# Altium schematic sheet SensorBoard.SchDoc
size A
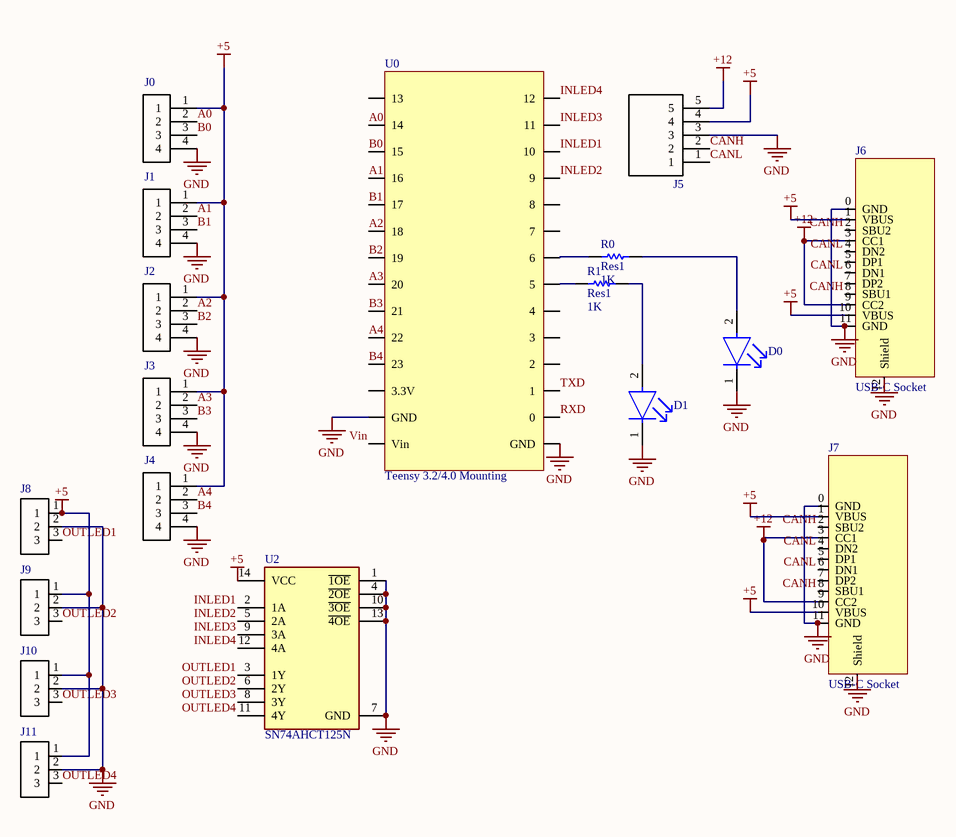
[diagram p0: SensorBoard.SchDoc]

## Parts
D0  Diode_Lumex_SSL-LX5093GD_eec  [Lumex_SSL-LX5093GD_0]  (value not drawn)
D1  Diode_Lumex_SSL-LX5093GD_eec  [Lumex_SSL-LX5093GD_0]  (value not drawn)
J0  282834-4  [*HDRV4W85P254_4X1_1062X650X1000]  (value not drawn)
J1  282834-4  [*HDRV4W85P254_4X1_1062X650X1000]  (value not drawn)
J2  282834-4  [*HDRV4W85P254_4X1_1062X650X1000]  (value not drawn)
J3  282834-4  [*HDRV4W85P254_4X1_1062X650X1000]  (value not drawn)
J4  282834-4  [*HDRV4W85P254_4X1_1062X650X1000]  (value not drawn)
J5  282834-5  [*TE_282834-5]  (value not drawn)
J6  USB-C Socket  [TYPE-C-31-M-12]
J7  USB-C Socket  [TYPE-C-31-M-12]
J8  282834-3  [*TE_282834-3]  (value not drawn)
J9  282834-3  [*TE_282834-3]  (value not drawn)
J10  282834-3  [*TE_282834-3]  (value not drawn)
J11  282834-3  [*TE_282834-3]  (value not drawn)
R0  Res1  value 1K  [AXIAL-0.3]
R1  Res1  value 1K  [AXIAL-0.3]
U0  Teensy 3.2/4.0 Mounting  [Teensy 3.2-4.0]
U2  Part Number: SN74AHCT125N  [Texas_Instruments_SN74AHCT125N_0]  (hidden comment: IC_Texas_Instruments_SN74AHCT125N_eec)

## Nets
+5: J0.1 J1.1 J2.1 J3.1 J4.1 J5.4 J6.1(VBUS) J6.10(VBUS) J7.1(VBUS) J7.10(VBUS) J8.1 J9.1 J10.1 J11.1 U2.14(VCC)
+12: J5.5 J6.3(CC1) J6.9(CC2) J7.3(CC1) J7.9(CC2)
GND: D0.1(C) D1.1(C) J0.4 J1.4 J2.4 J3.4 J4.4 J5.3 J6.0(GND) J6.11(GND) J6.12(Shield) J7.0(GND) J7.11(GND) J7.12(Shield) J8.2 J9.2 J10.2 J11.2 U0.GND U0.GND2(GND) U2.1(~{1OE}) U2.4(~{2OE}) U2.7(GND) U2.10(~{3OE}) U2.13(~{4OE})
A0: J0.2 U0.14
A1: J1.2 U0.16
A2: J2.2 U0.18
A3: J3.2 U0.20
A4: J4.2 U0.22
B0: J0.3 U0.15
B1: J1.3 U0.17
B2: J2.3 U0.19
B3: J3.3 U0.21
B4: J4.3 U0.23
CANH: J5.2 J6.2(SBU2) J6.8(SBU1) J7.2(SBU2) J7.8(SBU1)
CANL: J5.1 J6.4(DN2) J6.6(DN1) J7.4(DN2) J7.6(DN1)
INLED1: U0.10 U2.2(1A)
INLED2: U0.9 U2.5(2A)
INLED3: U0.11 U2.9(3A)
INLED4: U0.12 U2.12(4A)
OUTLED1: J8.3 U2.3(1Y)
OUTLED2: J9.3 U2.6(2Y)
OUTLED3: J10.3 U2.8(3Y)
OUTLED4: J11.3 U2.11(4Y)
RXD: U0.0
TXD: U0.1
Vin: U0.Vin
NetD0_2: D0.2(A) R0.2
NetD1_2: D1.2(A) R1.2
NetR0_1: R0.1 U0.6
NetR1_1: R1.1 U0.5

Not connected (* = marked no-connect by the designer): J6 5(DP1) 7(DP2); J7 5(DP1) 7(DP2); U0 2 3 3.3V 4 7 8 13

## Library data of the parts
D0 D1 = Diode_Lumex_SSL-LX5093GD_eec: DIODE LED GRN DIFF 5MM ROUND T/H; Manufacturer: Lumex; Current: 20mA; Voltage - Forward (Vf) (Typ): 2.2V; Viewing Angle: 60°; Part Number: SSL-LX5093GD; helpURL: https://upverter.com/upn/revision/3e2d87dde4bc0270/; ComponentLink2Description: Datasheet; Temperature: -40°C to +85°C; Package: RADIAL; Supplier 2: Mouser; Price: 0.134141512812; Supplier 1: Digi-Key; ComponentLink1URL: https://upverter.com/upn/revision/3e2d87dde4bc0270/; Supplier Part Number 2: 696-SSL-LX5093GD; Supplier Part Number 1: 67-1098-ND; ComponentLink1Description: Upverter; ComponentLink2URL: https://upverter.com/datasheet/272633366bbf9b7ac85ecec6850b6be956700e69.pdf; RoHS: TRUE; Mouser Part Number: 696-SSL-LX5093GD; Temperature Range High: +85°C; Digikey Description: DIODE LED GRN DIFF 5MM ROUND T/H; Digikey Part Number: 67-1098-ND; Lead Free: yes; Temperature Range Low: -40°C
J0-J4 = 282834-4: 4 Position Wire to Board Terminal Block Horizontal with Board 0.100 _2.54mm_ Through Hole; Number_of_Positions: 4; MF: TE Connectivity; Centerline_Pitch: 2.54 mm[.1 in]; Price: None; Package: None; TE_purchase_URL: https://www.te.com/usa-en/product-282834-4.html?te_bu=Cor&te_type=disp&te_campaign=seda_glo_cor-seda-global-disp-prtnr-fy19-seda-model-bom-cta_sma-317_1&elqCampaignId=32493; Availability: Unavailable; SnapEDA_Link: https://www.snapeda.com/parts/282834-4/TE%20Connectivity%20AMP%20Connectors/view-part/448422/?ref=snap; EU_RoHS_Compliance: Compliant with Exemptions; MP: 282834-4; Value: *
J5 = 282834-5: Buchanan; Conn; Term Blk; PCB; 5; 2.54mm; Front; 30-16 AWG; Green; 10 A; 150 V; MF: TE Connectivity; Price: None; SnapEDA_Link: https://www.snapeda.com/parts/282834-5/TE%20Connectivity%20AMP%20Connectors/view-part/641357/?ref=snap; EU_RoHS_Compliance: Compliant with Exemptions; MP: 282834-5; TE_purchase_URL: https://www.te.com/usa-en/product-282834-5.html?te_bu=Cor&te_type=disp&te_campaign=seda_glo_cor-seda-global-disp-prtnr-fy19-seda-model-bom-cta_sma-317_1&elqCampaignId=32493; Package: None; Availability: Unavailable; Value: *
J6 J7 = TYPE-C-31-M-12
J8-J11 = 282834-3: 3 Position Wire to Board Terminal Block Horizontal with Board 0.100 _2.54mm_; MF: TE Connectivity; Availability: Unavailable; Price: None; SnapEDA_Link: https://www.snapeda.com/parts/282834-3/TE%20Connectivity%20AMP%20Connectors/view-part/398089/?ref=snap; EU_RoHS_Compliance: Compliant with Exemptions; TE_purchase_URL: https://www.te.com/usa-en/product-282834-3.html?te_bu=Cor&te_type=disp&te_campaign=seda_glo_cor-seda-global-disp-prtnr-fy19-seda-model-bom-cta_sma-317_1&elqCampaignId=32493; MP: 282834-3; Package: None; Value: *
R0 R1 = Res1: Resistor; Published: 8-Jun-2000; LatestRevisionDate: 17-Jul-2002; LatestRevisionNote: Re-released for DXP Platform.; PackageReference: AXIAL-0.3; Publisher: Altium Limited; PackageDescription: Axial Device, Thru-Hole; 2 Leads; 0.3 in Pin Spacing
U0 = Teensy 3.2/4.0
U2 = IC_Texas_Instruments_SN74AHCT125N_eec: IC BUS BUFFER TRI-ST QD 14DIP; Manufacturer: Texas Instruments; helpURL: https://upverter.com/upn/revision/1c4f862725617c4f/; ComponentLink2Description: Datasheet; Temperature: -40°C to +125°C; Package: PDIP-14; Supplier 2: Mouser; Price: 0.244397165503; Supplier 1: Digi-Key; ComponentLink1URL: https://upverter.com/upn/revision/1c4f862725617c4f/; Supplier Part Number 2: 595-SN74AHCT125N; Supplier Part Number 1: 296-4655-5-ND; ComponentLink1Description: Upverter; ComponentLink2URL: http://www.ti.com/lit/ds/symlink/sn74ahct125.pdf; RoHS: TRUE; Mouser Part Number: 595-SN74AHCT125N; Ipc Land Pattern Name: DIP794W46P254L1930H508Q14; Temperature Range High: +125°C; Digikey Description: IC BUS BUFFER TRI-ST QD 14DIP; Digikey Part Number: 296-4655-5-ND; Lead Free: yes; Temperature Range Low: -40°C